# EAGLE design Main (EAGLE 8.7.1)
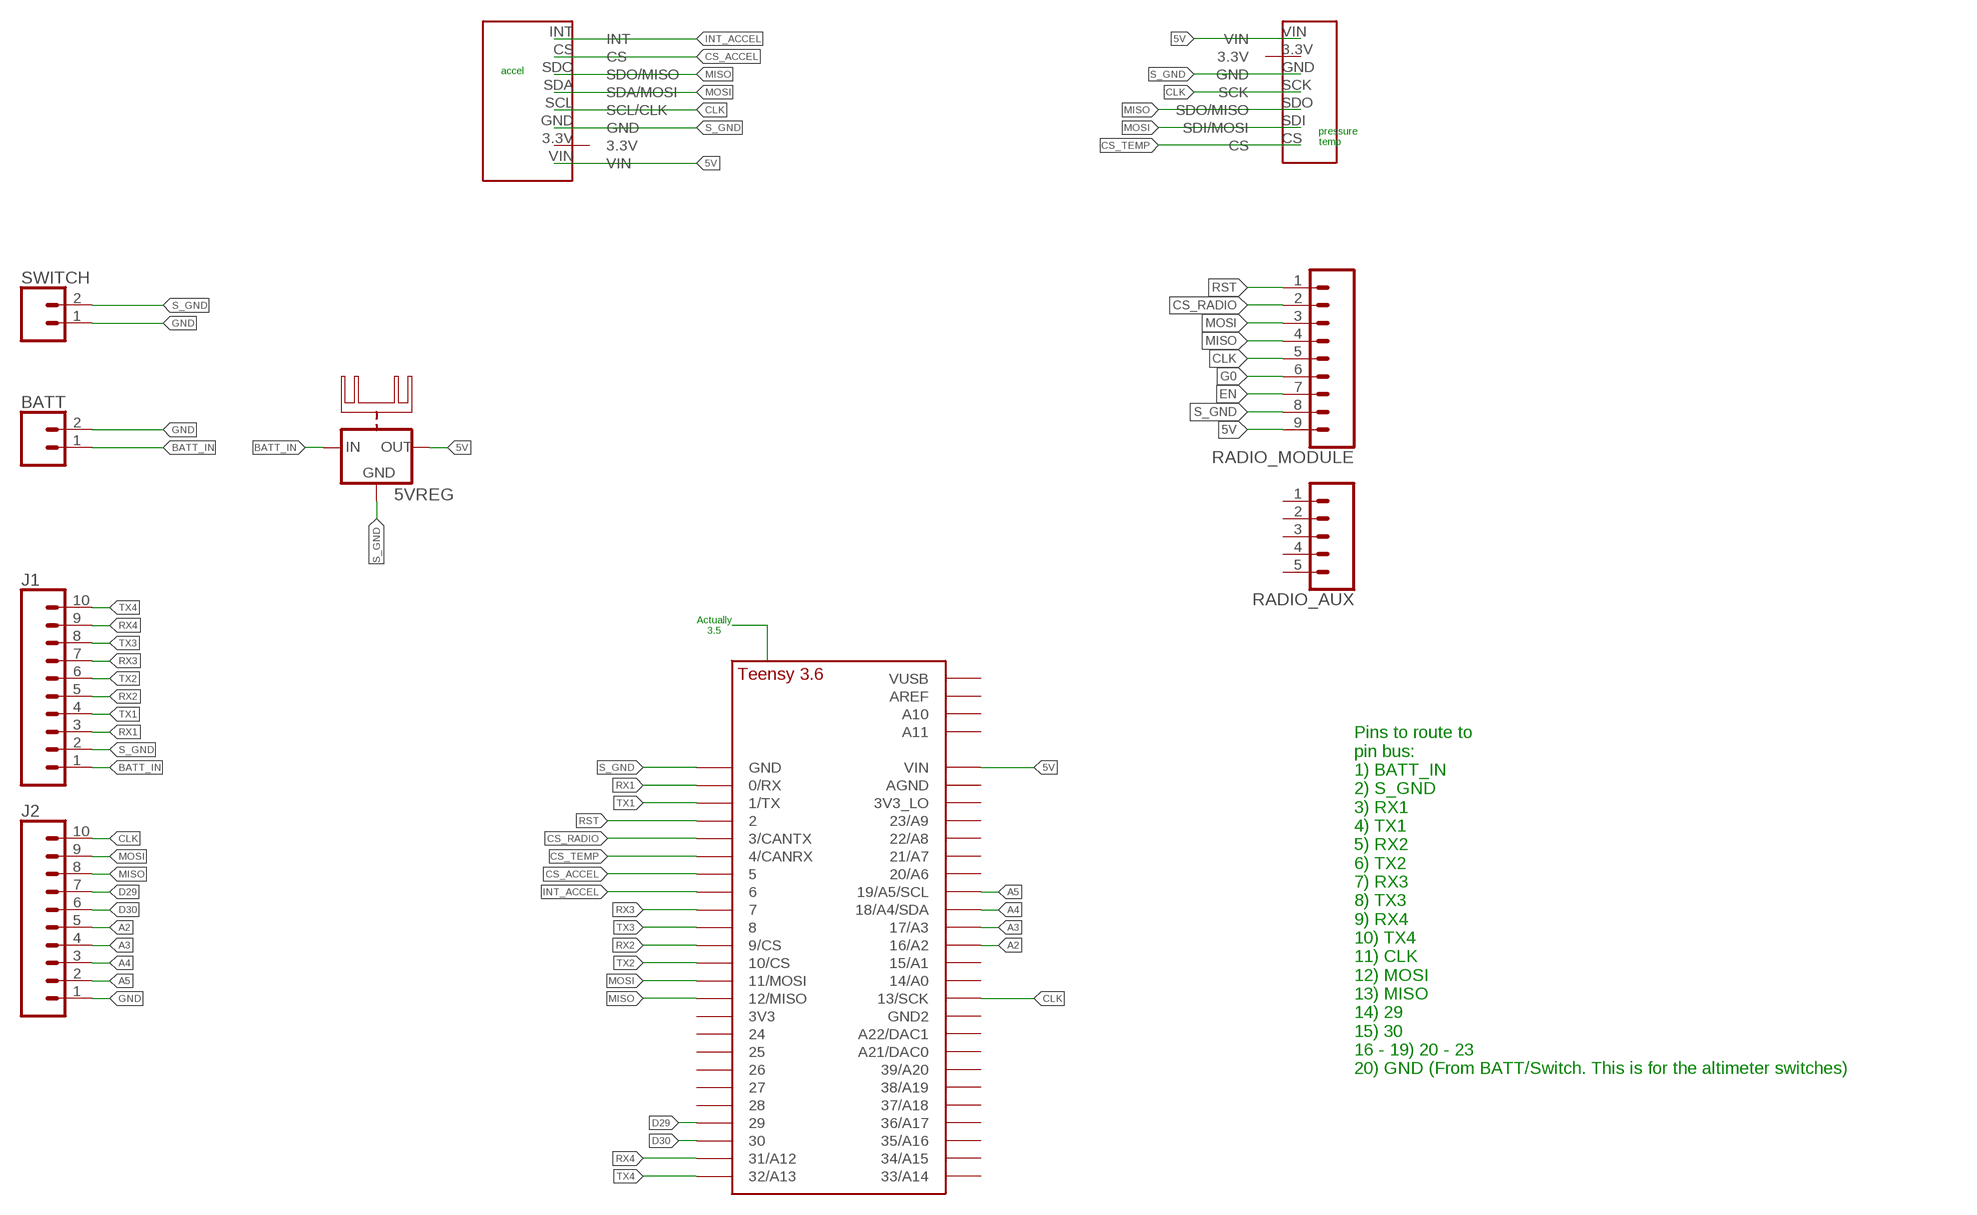
[diagram p0: schematic, sheet 1]

## Parts
5VREG  78XXH  [78XXH]
BATT  CONN_02-JST-2-PTH-NO_SILK  [JST-2-PTH-NS]
J1  CONN_10"  [1X10]
J2  CONN_10"  [1X10]
RADIO_AUX  CONN_05  [1X05]
RADIO_MODULE  CONN_09  [1X09]
SWITCH  CONN_02-JST-2-PTH-NO_SILK  [JST-2-PTH-NS]
U$1  TEENSY_3.5/3.6_BASIC  [TEENSY_3.5/3.6_BASIC]
U$2  LIS3DH  [LIS3DH]
U$3  BMP280  [BMP280]

## Nets
5V: 5VREG.OUT RADIO_MODULE.9 U$1.VIN U$2.VIN U$3.VIN
A2: J2.5 U$1.16/A2
A3: J2.4 U$1.17/A3
A4: J2.3 U$1.18/A4/SDA
A5: J2.2 U$1.19/A5/SCL
BATT_IN: 5VREG.IN BATT.1 J1.1
CLK: J2.10 RADIO_MODULE.5 U$1.13/SCK U$2.SCL(SCL/CLK) U$3.SCK
CS_ACCEL: U$1.5 U$2.CS
CS_RADIO: RADIO_MODULE.2 U$1.3/CANTX
CS_TEMP: U$1.4/CANRX U$3.CS
D29: J2.7 U$1.29
D30: J2.6 U$1.30
EN: RADIO_MODULE.7
G0: RADIO_MODULE.6
GND: BATT.2 J2.1 SWITCH.1
INT_ACCEL: U$1.6 U$2.INT
MISO: J2.8 RADIO_MODULE.4 U$1.12/MISO U$2.SDO(SDO/MISO) U$3.SDO(SDO/MISO)
MOSI: J2.9 RADIO_MODULE.3 U$1.11/MOSI U$2.SDA(SDA/MOSI) U$3.SDI(SDI/MOSI)
RST: RADIO_MODULE.1 U$1.2
RX1: J1.3 U$1.0/RX
RX2: J1.5 U$1.9/CS
RX3: J1.7 U$1.7
RX4: J1.9 U$1.31/A12
S_GND: 5VREG.GND J1.2 RADIO_MODULE.8 SWITCH.2 U$1.GND U$2.GND U$3.GND
TX1: J1.4 U$1.1/TX
TX2: J1.6 U$1.10/CS
TX3: J1.8 U$1.8
TX4: J1.10 U$1.32/A13
Unconnected: RADIO_AUX.1 RADIO_AUX.2 RADIO_AUX.3 RADIO_AUX.4 RADIO_AUX.5 U$1.3V3 U$1.3V3_LO U$1.14/A0 U$1.15/A1 U$1.20/A6 U$1.21/A7 U$1.21/DAC0(A21/DAC0) U$1.22/A8 U$1.23/A9 U$1.24 U$1.25 U$1.26 U$1.27 U$1.28 U$1.33/A14 U$1.34/A15 U$1.35/A16 U$1.36/A17 U$1.37/A18 U$1.38/A19 U$1.39/A20 U$1.A10 U$1.A11 U$1.A22/DAC1 U$1.AGND U$1.AREF U$1.GND2 U$1.VUSB U$2.3.3V U$3.3.3V

## Notes on the sheet
- accel
- pressure
  temp
- Actually
  3.5
- Pins to route to 
  pin bus:
  1) BATT_IN
  2) S_GND
  3) RX1
  4) TX1
  5) RX2
  6) TX2
  7) RX3
  8) TX3
  9) RX4
  10) TX4
  11) CLK
  12) MOSI
  13) MISO
  14) 29
  15) 30
  16 - 19) 20 - 23
  20) GND (From BATT/Switch. This is for the altimeter switches)

## Library data of the parts
5VREG = 78xx_with_heatsink:78XXH: VOLTAGE REGULATOR
BATT SWITCH = SparkFun-Connectors:CONN_02: Multi connection point. Often used as Generic Header-pin footprint for 0.1 inch spaced/style header connections On any of the 0.1 inch spaced packages, you can populate with these: Break Away Headers - Straight <https://www.sparkfun.com/products/116> (PRT-00116) Break Away Male Headers - Right Angle <https://www.sparkfun.com/products/553> (PRT-00553) Female Headers <https://www.sparkfun.com/products/115> (PRT-00115) Break Away Headers - Machine Pin <https://www.sparkfun.com/products/117> (PRT-00117) Break Away Female Headers - Swiss Machine Pin <https://www.sparkfun.com/products/743> (PRT-00743) For SCREWTERMINALS and SPRING TERMINALS visit here: Screw Terimnals on SparkFun.com <https://www.sparkfun.com/search/results?term=Screw+Terminals> (5mm/3.5mm/2.54mm spacing) This device is also useful as a general connection point to wire up your design to another part of your project. Our various solder wires solder well into these plated through hole pads. Hook-Up Wire - Assortment (Stranded, 22 AWG) <https://www.sparkfun.com/products/11375> (PRT-11375) Hook-Up Wire - Assortment (Solid Core, 22 AWG) <https://www.sparkfun.com/products/11367> (PRT-11367) View the entire wire category on our website here <https://www.sparkfun.com/categories/141> Special notes: Molex polarized connector foot print use with: PRT-08233 with associated crimp pins and housings. 2.54_SCREWTERM for use with PRT-10571. 3.5mm Screw Terminal footprints for PRT-08084 5mm Screw Terminal footprints for use with PRT-08432
J1 J2 = SparkFun-Connectors:CONN_10: Multi connection point. Often used as Generic Header-pin footprint for 0.1 inch spaced/style header connections On any of the 0.1 inch spaced packages, you can populate with these: Break Away Headers - Straight <https://www.sparkfun.com/products/116> (PRT-00116) Break Away Male Headers - Right Angle <https://www.sparkfun.com/products/553> (PRT-00553) Female Headers <https://www.sparkfun.com/products/115> (PRT-00115) Break Away Headers - Machine Pin <https://www.sparkfun.com/products/117> (PRT-00117) Break Away Female Headers - Swiss Machine Pin <https://www.sparkfun.com/products/743> (PRT-00743) Arduino Stackable Header - 10 Pin <https://www.sparkfun.com/products/11376> (PRT-11376) For SCREWTERMINALS and SPRING TERMINALS visit here: Screw Terimnals on SparkFun.com <https://www.sparkfun.com/search/results?term=Screw+Terminals> (5mm/3.5mm/2.54mm spacing) This device is also useful as a general connection point to wire up your design to another part of your project. Our various solder wires solder well into these plated through hole pads. Hook-Up Wire - Assortment (Stranded, 22 AWG) <https://www.sparkfun.com/products/11375> (PRT-11375) Hook-Up Wire - Assortment (Solid Core, 22 AWG) <https://www.sparkfun.com/products/11367> (PRT-11367) View the entire wire category on our website here <https://www.sparkfun.com/categories/141> Special notes: Molex polarized connector foot print use with SKU : PRT-08231 with associated crimp pins and housings. 1MM SMD Version SKU: PRT-10208 NOTES ON THE VARIANTS LOCK and LOCK_LONGPADS... This footprint was designed to help hold the alignment of a through-hole component (i.e. 6-pin header) while soldering it into place. You may notice that each hole has been shifted either up or down by 0.005 of an inch from it's more standard position (which is a perfectly straight line). This slight alteration caused the pins (the squares in the middle) to touch the edges of the holes. Because they are alternating, it causes a "brace" to hold the component in place. 0.005 has proven to be the perfect amount of "off-center" position when using our standard breakaway headers. Although looks a little odd when you look at the bare footprint, once you have a header in there, the alteration is very hard to notice. Also,if you push a header all the way into place, it is covered up entirely on the bottom side.; PROD_ID: CONN-11563
RADIO_AUX = SparkFun-Connectors:CONN_05: Multi connection point. Often used as Generic Header-pin footprint for 0.1 inch spaced/style header connections On any of the 0.1 inch spaced packages, you can populate with these: Break Away Headers - Straight <https://www.sparkfun.com/products/116> (PRT-00116) Break Away Male Headers - Right Angle <https://www.sparkfun.com/products/553> (PRT-00553) Female Headers <https://www.sparkfun.com/products/115> (PRT-00115) Break Away Headers - Machine Pin <https://www.sparkfun.com/products/117> (PRT-00117) Break Away Female Headers - Swiss Machine Pin <https://www.sparkfun.com/products/743> (PRT-00743) For SCREWTERMINALS and SPRING TERMINALS visit here: Screw Terimnals on SparkFun.com <https://www.sparkfun.com/search/results?term=Screw+Terminals> (5mm/3.5mm/2.54mm spacing) This device is also useful as a general connection point to wire up your design to another part of your project. Our various solder wires solder well into these plated through hole pads. Hook-Up Wire - Assortment (Stranded, 22 AWG) <https://www.sparkfun.com/products/11375> (PRT-11375) Hook-Up Wire - Assortment (Solid Core, 22 AWG) <https://www.sparkfun.com/products/11367> (PRT-11367) View the entire wire category on our website here <https://www.sparkfun.com/categories/141> Special notes: Molex polarized connector foot print use with SKU : PRT-08231 with associated crimp pins and housings. 1MM SMD Version SKU: PRT-10208
RADIO_MODULE = SparkFun-Connectors:CONN_09: Multi connection point. Often used as Generic Header-pin footprint for 0.1 inch spaced/style header connections On any of the 0.1 inch spaced packages, you can populate with these: Break Away Headers - Straight <https://www.sparkfun.com/products/116> (PRT-00116) Break Away Male Headers - Right Angle <https://www.sparkfun.com/products/553> (PRT-00553) Female Headers <https://www.sparkfun.com/products/115> (PRT-00115) Break Away Headers - Machine Pin <https://www.sparkfun.com/products/117> (PRT-00117) Break Away Female Headers - Swiss Machine Pin <https://www.sparkfun.com/products/743> (PRT-00743) For SCREWTERMINALS and SPRING TERMINALS visit here: Screw Terimnals on SparkFun.com <https://www.sparkfun.com/search/results?term=Screw+Terminals> (5mm/3.5mm/2.54mm spacing) This device is also useful as a general connection point to wire up your design to another part of your project. Our various solder wires solder well into these plated through hole pads. Hook-Up Wire - Assortment (Stranded, 22 AWG) <https://www.sparkfun.com/products/11375> (PRT-11375) Hook-Up Wire - Assortment (Solid Core, 22 AWG) <https://www.sparkfun.com/products/11367> (PRT-11367) View the entire wire category on our website here <https://www.sparkfun.com/categories/141> Special notes: Molex polarized connector foot print use with SKU : PRT-08231 with associated crimp pins and housings. 1MM SMD Version SKU: PRT-10208 NOTES ON THE VARIANTS LOCK and LOCK_LONGPADS... This footprint was designed to help hold the alignment of a through-hole component (i.e. 6-pin header) while soldering it into place. You may notice that each hole has been shifted either up or down by 0.005 of an inch from it's more standard position (which is a perfectly straight line). This slight alteration caused the pins (the squares in the middle) to touch the edges of the holes. Because they are alternating, it causes a "brace" to hold the component in place. 0.005 has proven to be the perfect amount of "off-center" position when using our standard breakaway headers. Although looks a little odd when you look at the bare footprint, once you have a header in there, the alteration is very hard to notice. Also,if you push a header all the way into place, it is covered up entirely on the bottom side.
U$1 = Teensy356:TEENSY_3.5/3.6_BASIC
U$2 = Butch Adafruit:LIS3DH
U$3 = Butch Adafruit:BMP280

## Board
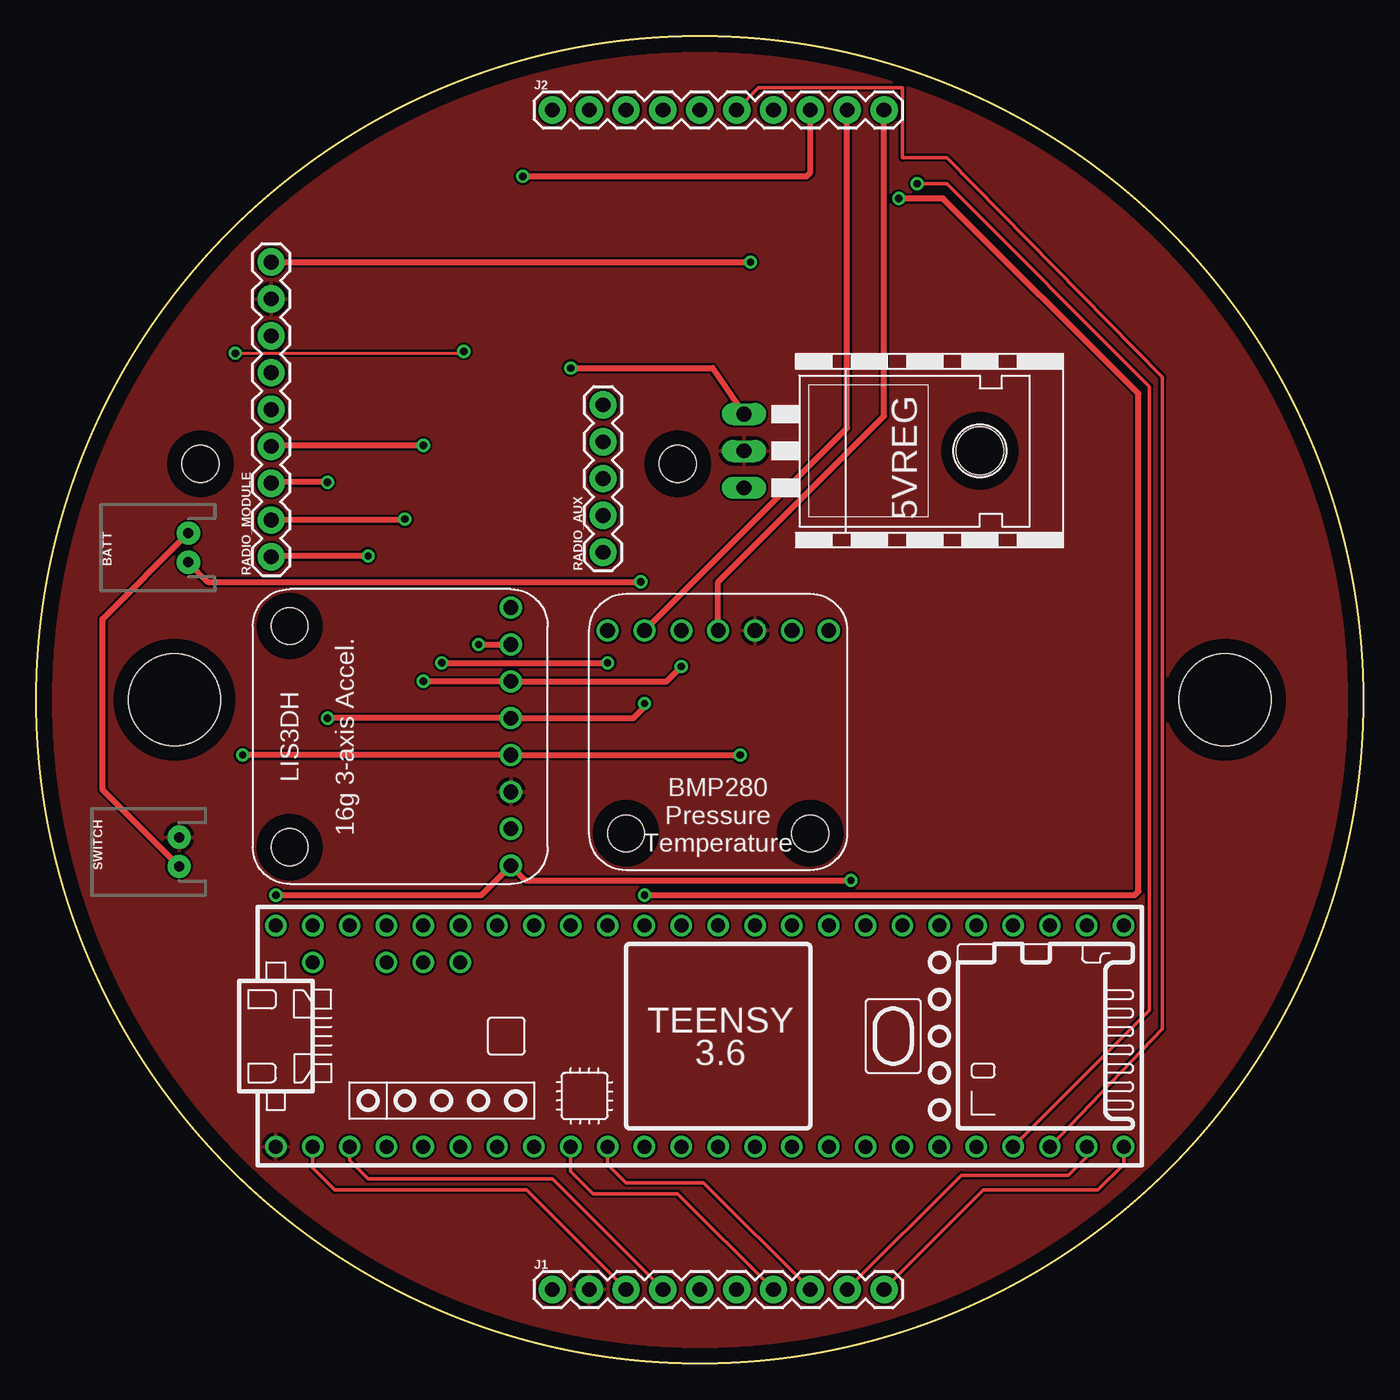
[diagram p1: board, top side]
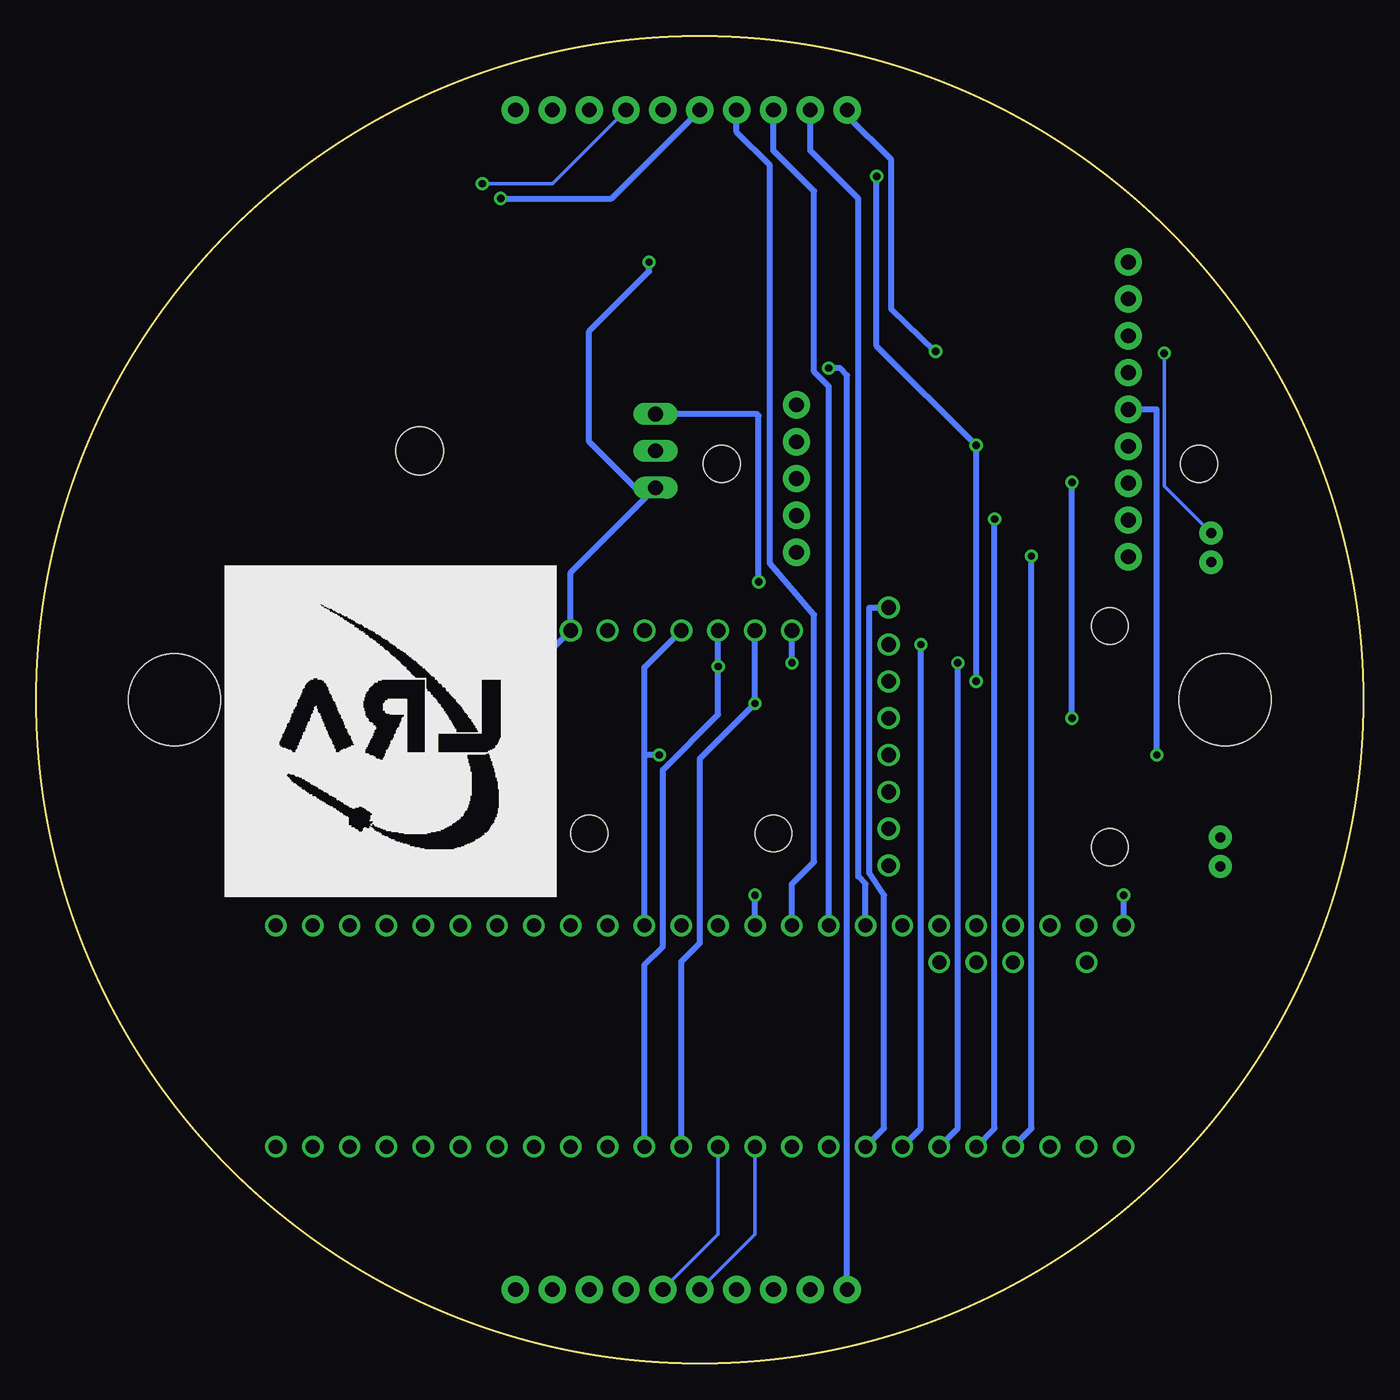
[diagram p2: board, bottom side, seen from below]

Size 91.44 x 91.44 mm. Coordinates in mm from the lower left corner, seen from the top.
Outline: circle at 45.72,45.72 radius 45.72
Copper layers (1*16): Top 0.035mm / dielectric 1.5mm / Bottom 0.035mm
Design rules "default": minimum track width 6mil, minimum drill 0.35mm, track to track 6mil, track to pad 6mil, pad to pad 6mil, via to via 6mil, smd to smd 6mil, copper to edge 40mil, drill to drill 6mil, minimum pad ring 10mil, minimum via ring 8mil, stop-mask expansion 4mil, vias tented up to drill 0mil, thermal gap 10mil
Holes 6.35 mm at 9.53,45.72 81.92,45.72
Holes 2.54 mm at 44.2,61.98 11.3,61.98

### Footprints (pad centres in the part's own frame; a part is rotated, then mirrored left to right if it is on the bottom)
78XXH = drill 1.016 long: GND 0,-5.08; IN -2.54,-5.08; OUT 2.54,-5.08 | hole 3.302: 0,11.176
JST-2-PTH-NS = drill 0.7 pad 1.6: 1 -1,0; 2 1,0
1X10 = drill 1.016 pad 1.88: 1 0,0; 2 2.54,0; 3 5.08,0; 4 7.62,0; 5 10.16,0; 6 12.7,0; 7 15.24,0; 8 17.78,0; 9 20.32,0; 10 22.86,0
1X05 = drill 1.016 pad 1.88: 1 0,0; 2 2.54,0; 3 5.08,0; 4 7.62,0; 5 10.16,0
1X09 = drill 1.016 pad 1.88: 1 0,0; 2 2.54,0; 3 5.08,0; 4 7.62,0; 5 10.16,0; 6 12.7,0; 7 15.24,0; 8 17.78,0; 9 20.32,0
TEENSY_3.5/3.6_BASIC = drill 0.965: 0/RX -25.4,-7.62; 1/TX -22.86,-7.62; 2 -20.32,-7.62; 3/CANTX -17.78,-7.62; 3V3 7.62,-7.62; 3V3_LO -22.86,7.62; 4/CANRX -15.24,-7.62; 5 -12.7,-7.62; 6 -10.16,-7.62; 7 -7.62,-7.62; 8 -5.08,-7.62; 9/CS -2.54,-7.62; 10/CS 0,-7.62; 11/MOSI 2.54,-7.62; 12/MISO 5.08,-7.62; 13/SCK 5.08,7.62; 14/A0 2.54,7.62; 15/A1 0,7.62; 16/A2 -2.54,7.62; 17/A3 -5.08,7.62; 18/A4/SDA -7.62,7.62; 19/A5/SCL -10.16,7.62; 20/A6 -12.7,7.62; 21/A7 -15.24,7.62; 21/DAC0 12.7,7.62; 22/A8 -17.78,7.62; 23/A9 -20.32,7.62; 24 10.16,-7.62; 25 12.7,-7.62; 26 15.24,-7.62; 27 17.78,-7.62; 28 20.32,-7.62; 29 22.86,-7.62; 30 25.4,-7.62; 31/A12 27.94,-7.62; 32/A13 30.48,-7.62; 33/A14 30.48,7.62; 34/A15 27.94,7.62; 35/A16 25.4,7.62; 36/A17 22.86,7.62; 37/A18 20.32,7.62; 38/A19 17.78,7.62; 39/A20 15.24,7.62; A10 -17.78,5.08; A11 -15.24,5.08; A22/DAC1 10.16,7.62; AGND -25.4,7.62; AREF -20.32,5.08; GND -27.94,-7.62; GND2 7.62,7.62; VIN -27.94,7.62; VUSB -25.4,5.08
LIS3DH = drill 1.016: 3.3V 3.81,2.54; CS 16.51,2.54; GND 6.35,2.54; INT 19.05,2.54; SCL 8.89,2.54; SDA 11.43,2.54; SDO 13.97,2.54; VIN 1.27,2.54 | hole 2.54: 2.54,17.78; 17.78,17.78
BMP280 = drill 1.016: 3.3V 3.81,2.54; CS 16.51,2.54; GND 6.35,2.54; SCK 8.89,2.54; SDI 13.97,2.54; SDO 11.43,2.54; VIN 1.27,2.54 | hole 2.54: 2.54,16.51; 15.24,16.51

### Placement (x,y rotation side)
5VREG  53.85,62.87 270 top
BATT  10.48,56.2 90 top
J1  35.56,5.08 0 top
J2  35.56,86.36 0 top
RADIO_AUX  39.05,55.88 90 top
RADIO_MODULE  16.19,55.56 90 top
SWITCH  9.84,35.24 90 top
U$1  44.45,22.54 0 top
U$2  35.24,33.02 90 top
U$3  55.88,53.02 180 top

### Tracks (layer width: path | path; a pad name or v marks a point on that pad's centre or on a via)
5V  (via drill 0.5)
  Top 0.406: v56.13,33.27 33.72,33.27 U$2.VIN 30.67,32.26 v16.51,32.26 | RADIO_MODULE.9 v49.21,75.88
  Bottom 0.406: v56.13,33.27 56.13,48.96 U$3.VIN 54.61,54.48 5VREG.OUT 50.16,60.33 53.34,63.5 53.34,71.12 49.21,75.25 v49.21,75.88 | U$1.VIN v16.51,32.26
A2  (via drill 0.5)
  Top 0.406: v41.91,32.26 75.69,32.26 75.95,32.51 75.95,66.8 62.48,80.26 v59.44,80.26
  Bottom 0.406: v59.44,80.26 51.82,80.26 J2.5 | U$1.16/A2 v41.91,32.26
A3
  Bottom 0.406: U$1.17/A3 39.37,33.02 37.85,34.54 37.85,51.56 40.89,55.12 40.89,82.55 43.18,84.84 J2.4
A4
  Bottom 0.406: U$1.18/A4/SDA 36.83,67.31 37.85,68.33 37.85,80.77 40.64,83.57 J2.3
A5
  Bottom 0.406: U$1.19/A5/SCL 34.29,33.02 34.8,33.53 34.8,80.26 38.1,83.57 J2.2
BATT_IN  (via drill 0.5)
  Top 0.406: BATT.1 11.83,53.85 v41.66,53.85 | v36.83,68.58 46.61,68.58 5VREG.IN
  Bottom 0.406: v41.66,53.85 41.66,65.28 41.78,65.41 5VREG.IN | J1.1 35.56,68.07 36.07,68.58 v36.83,68.58
CLK  (via drill 0.5)
  Top 0.406: v48.51,41.91 U$2.SCL v14.22,41.91 | U$3.SCK 46.99,53.85 58.42,65.28 J2.10
  Bottom 0.406: U$1.13/SCK 49.53,41.91 | 49.53,41.91 49.53,47.94 U$3.SCK | v48.51,41.91 49.53,41.91 | v14.22,41.91 14.22,65.72 RADIO_MODULE.5
CS_ACCEL  (via drill 0.5)
  Top 0.406: v30.48,49.53 U$2.CS
  Bottom 0.406: U$1.5 30.48,16.19 v30.48,49.53
CS_RADIO  (via drill 0.5)
  Top 0.406: v25.4,58.17 25.34,58.1 RADIO_MODULE.2
  Bottom 0.406: U$1.3/CANTX 25.4,16.19 v25.4,58.17
CS_TEMP  (via drill 0.5)
  Top 0.406: v27.94,48.26 v39.37,48.26
  Bottom 0.406: U$1.4/CANRX 27.94,16.19 v27.94,48.26 | v39.37,48.26 U$3.CS
D29  (via drill 0.5)
  Top 0.254: U$1.29 76.71,24.32 76.71,67.31 62.74,81.28 v60.71,81.28
  Bottom 0.254: v60.71,81.28 55.88,81.28 J2.7
D30
  Top 0.254: U$1.30 77.6,23.05 77.6,67.94 62.74,83.06 59.69,83.06 59.69,87.88 49.78,87.88 J2.6
GND  (via drill 0.5)
  Top 0.203: v13.72,69.6 29.34,69.6
  Top 0.254: 29.34,69.6 v29.46,69.72
  Top 0.406: SWITCH.1 4.57,39.51 4.57,51.29 BATT.2
  Bottom 0.254: BATT.2 13.72,60.44 v13.72,69.6
  Bottom 0.406: v29.46,69.72 32.51,72.64 32.51,82.93 35.56,85.98 J2.1
INT_ACCEL
  Bottom 0.406: U$1.6 33.02,16.19 33.02,32.26 34.04,33.78 34.04,52.07 U$2.INT
MISO  (via drill 0.5)
  Top 0.406: v44.45,48.01 43.43,46.99 U$2.SDO v26.67,46.99 | v26.67,63.25 16.26,63.25 RADIO_MODULE.4 | v33.53,81.79 53.09,81.79 53.34,82.04 J2.8
  Bottom 0.406: U$3.SDO v44.45,48.01 44.45,44.7 48.26,40.89 48.26,28.7 49.53,27.43 U$1.12/MISO | v26.67,46.99 v26.67,63.25 33.53,70.1 v33.53,81.79
MOSI  (via drill 0.5)
  Top 0.406: v41.91,45.47 41.91,45.21 41.15,44.45 U$2.SDA v20.07,44.45 | v20.07,60.71 16.26,60.71 RADIO_MODULE.3 | U$3.SDI 55.88,64.45 J2.9
  Bottom 0.406: U$3.SDI v41.91,45.47 45.72,41.66 45.72,28.96 46.99,27.69 U$1.11/MOSI | v20.07,44.45 v20.07,60.71
RST  (via drill 0.5)
  Top 0.406: v22.86,55.63 16.26,55.63 RADIO_MODULE.1
  Bottom 0.406: U$1.2 22.86,16.19 v22.86,55.63
RX1
  Top 0.254: J1.3 33.78,11.94 20.57,11.94 19.05,13.46 U$1.0/RX
RX2
  Bottom 0.254: J1.5 41.91,8.89 U$1.9/CS
RX3
  Top 0.254: J1.7 44.2,11.68 38.35,11.68 36.83,13.21 U$1.7
RX4
  Top 0.254: J1.9 63.75,12.95 71.12,12.95 72.39,14.22 U$1.31/A12
S_GND
  pour Top: 45.72,91.44 arc90 0,45.72 arc90 45.72,0 arc90 91.44,45.72 arc90
TX1
  Top 0.254: J1.4 35.56,12.7 22.86,12.7 21.59,13.97 U$1.1/TX
TX2
  Bottom 0.254: J1.6 44.45,8.89 U$1.10/CS
TX3
  Top 0.254: J1.8 45.97,12.45 40.64,12.45 39.37,13.72 U$1.8
TX4
  Top 0.254: J1.10 65.28,11.94 73.15,11.94 74.93,13.72 U$1.32/A13

### Text on the board
tOrigins: Longhorn Rocketry Association | University of Texas at Austin | Flight Computer uC Board